# EasyEDA Pro project ProProject_智芯-TI驱动板_2024-06-05.epro

# Schematic Schematic1
Create Date: 2024-04-11; Page Name: P1; Project Name: 智芯-TI驱动板; Schematic Name: Schematic1; Update Date: 2024-04-12; Company: 嘉立创EDA; Page Size: A4; Version: V1.0
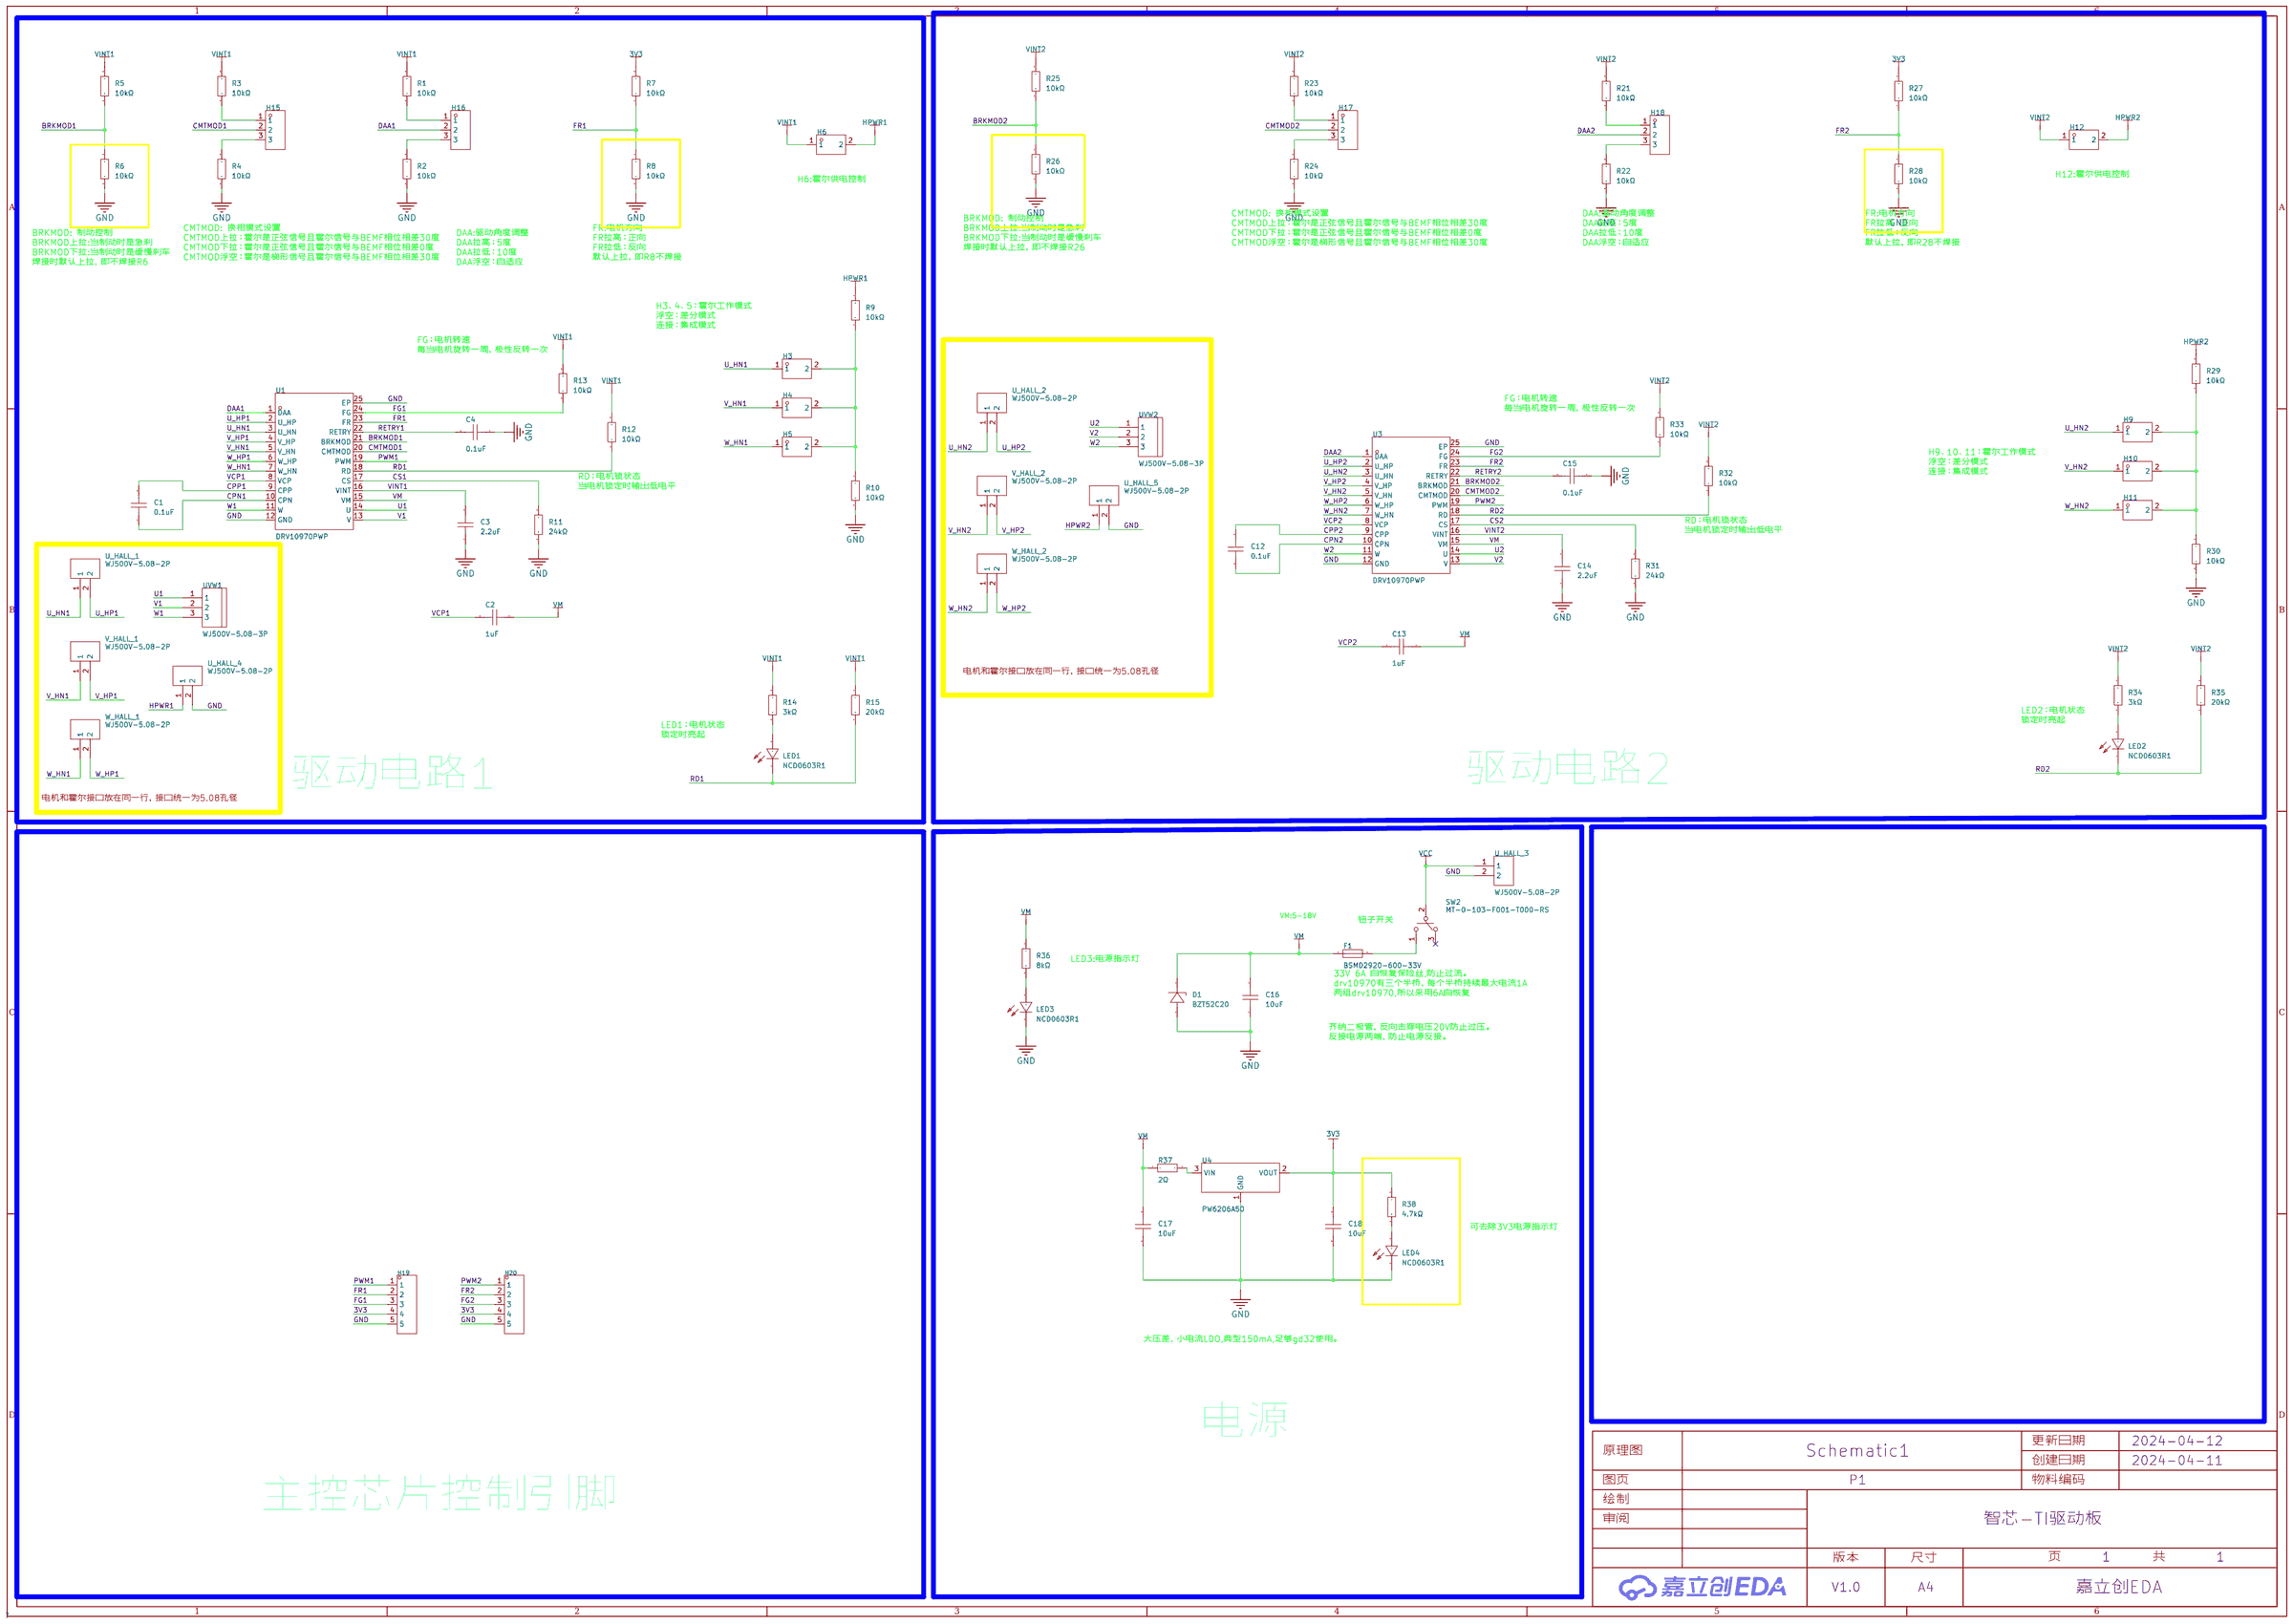
[diagram p0: schematic sheet]

## Parts
C1  0.1uF  [C0603]
C2  1uF  [C0603]
C3  2.2uF  [C0603]
C4  0.1uF  [C0603]
C12  0.1uF  [C0603]
C13  1uF  [C0603]
C14  2.2uF  [C0603]
C15  0.1uF  [C0603]
C16  10uF  [C0603]
C17  10uF  [C0603]
C18  10uF  [C0603]
D1  BZT52C20  [SOD-123_L2.7-W1.6-LS3.7-RD-1]
F1  BSMD2920-600-33V  [F2920]
H3  -  [HDR-TH_2P-P2.54-V-M-2]
H4  -  [HDR-TH_2P-P2.54-V-M-2]
H5  -  [HDR-TH_2P-P2.54-V-M-2]
H6  -  [HDR-TH_2P-P2.54-V-M-2]
H9  -  [HDR-TH_2P-P2.54-V-M-2]
H10  -  [HDR-TH_2P-P2.54-V-M-2]
H11  -  [HDR-TH_2P-P2.54-V-M-2]
H12  -  [HDR-TH_2P-P2.54-V-M-2]
H15  -  [HDR-TH_3P-P2.54-V-M]
H16  -  [HDR-TH_3P-P2.54-V-M]
H17  -  [HDR-TH_3P-P2.54-V-M]
H18  -  [HDR-TH_3P-P2.54-V-M]
H19  -  [HDR-TH_5P-P2.54-V-M]
H20  -  [HDR-TH_5P-P2.54-V-M]
LED1  NCD0603R1  [LED0603-RD_RED]
LED2  NCD0603R1  [LED0603-RD_RED]
LED3  NCD0603R1  [LED0603-RD_RED]
LED4  NCD0603R1  [LED0603-RD_RED]
R1  10kΩ  [R0603]
R2  10kΩ  [R0603]
R3  10kΩ  [R0603]
R4  10kΩ  [R0603]
R5  10kΩ  [R0603]
R6  10kΩ  [R0603]
R7  10kΩ  [R0603]
R8  10kΩ  [R0603]
R9  10kΩ  [R0603]
R10  10kΩ  [R0603]
R11  24kΩ  [R0603]
R12  10kΩ  [R0603]
R13  10kΩ  [R0603]
R14  3kΩ  [R0603]
R15  20kΩ  [R0603]
R21  10kΩ  [R0603]
R22  10kΩ  [R0603]
R23  10kΩ  [R0603]
R24  10kΩ  [R0603]
R25  10kΩ  [R0603]
R26  10kΩ  [R0603]
R27  10kΩ  [R0603]
R28  10kΩ  [R0603]
R29  10kΩ  [R0603]
R30  10kΩ  [R0603]
R31  24kΩ  [R0603]
R32  10kΩ  [R0603]
R33  10kΩ  [R0603]
R34  3kΩ  [R0603]
R35  20kΩ  [R0603]
R36  8kΩ  [R0603]
R37  2Ω  [R0603]
R38  4.7kΩ  [R0603]
SW2  MT-0-103-F001-T000-RS  [SW-TH_MT-0-103-A101-M200-RS]
U1  DRV10970PWP  [HTSSOP-24_L7.8-W4.4-P0.65-LS6.4-BL-EP]
U3  DRV10970PWP  [HTSSOP-24_L7.8-W4.4-P0.65-LS6.4-BL-EP]
U4  PW6206A50  [SOT-23-3_L2.9-W1.6-P1.90-LS2.8-BR]
U_HALL_1  WJ500V-5.08-2P  [CONN-TH_2P-P5.00_WJ500V-5.08-2P]
U_HALL_2  WJ500V-5.08-2P  [CONN-TH_2P-P5.00_WJ500V-5.08-2P]
U_HALL_3  WJ500V-5.08-2P  [CONN-TH_2P-P5.00_WJ500V-5.08-2P]
U_HALL_4  WJ500V-5.08-2P  [CONN-TH_2P-P5.00_WJ500V-5.08-2P]
U_HALL_5  WJ500V-5.08-2P  [CONN-TH_2P-P5.00_WJ500V-5.08-2P]
UVW1  WJ500V-5.08-3P  [CONN-TH_3P-P5.00_WJ500V-5.08-3P]
UVW2  WJ500V-5.08-3P  [CONN-TH_3P-P5.00_WJ500V-5.08-3P]
V_HALL_1  WJ500V-5.08-2P  [CONN-TH_2P-P5.00_WJ500V-5.08-2P]
V_HALL_2  WJ500V-5.08-2P  [CONN-TH_2P-P5.00_WJ500V-5.08-2P]
W_HALL_1  WJ500V-5.08-2P  [CONN-TH_2P-P5.00_WJ500V-5.08-2P]
W_HALL_2  WJ500V-5.08-2P  [CONN-TH_2P-P5.00_WJ500V-5.08-2P]

## Library data of the parts
C1-C4 C12-C18 = CC0603KRX7R9BB104: 容值:100nF;精度:±10%;额定电压:50V;材质(温度系数):X7R;; LCSC Part Name: 100nF ±10% 50V; Supplier Part: C14663; Manufacturer: YAGEO(国巨); Supplier Footprint: 0603; JLCPCB Part Class: 基础库; Datasheet: https://atta.szlcsc.com/upload/public/pdf/source/20180910/C282072_33301C7F631E79921B82A8DAC6BCC5B3.pdf; Supplier: LCSC; Tolerance: ±10%; Voltage Rated: 50V; Temperature Coefficient: X7R
D1 = BZT52C20_C511888: 二极管配置:独立式;稳压值(标称值):20V;稳压值(范围):18.8V~21.2V;功率:500mW;精度:-;; Supplier Part: C511888; Manufacturer: BORN(伯恩半导体); Supplier Footprint: SOD-123; JLCPCB Part Class: 扩展库; Datasheet: https://atta.szlcsc.com/upload/public/pdf/source/20180820/C271262_D2D0F24DD5A81EAE2A6B8B493A94E64A.pdf; Supplier: LCSC; Diode Configuration: 独立式; Zener Voltage (Nom): 20V; Reverse Leakage Current (Ir): 100nA@14V; Zener Voltage (Range): 18.8V~21.2V; Power Dissipation: 500mW; Zener Impedance (Zzt): 55Ω
F1 = BSMD2920-600-16V: 最大电压:16V;最大电流:40A;保持电流:6A;跳闸电流:12A;; LCSC Part Name: 2920 6A 16V 佰宏大电流; Supplier Part: C910847; Manufacturer: BHFUSE(佰宏); Supplier Footprint: 2920; JLCPCB Part Class: 扩展库; Datasheet: https://atta.szlcsc.com/upload/public/pdf/source/20230512/D022CCFE0A7F15633C929F419B252442.pdf; Supplier: LCSC; Operating Voltage (Max): 16V; Current Rating (Max): 40A; Hold Current: 6A; Trip Current: 12A; Power Dissipation: 2W; Resistance - Initial (Ri) (Min): 4mΩ; Resistance - Post Trip (R1) (Max): 20mΩ; Maximum Time to Trip: 6s; Operating Temperature: -40℃~+85℃
H3-H6 H9-H12 = HDR-M_2.54_2x1: Supplier Part: C2883961; Supplier Footprint: 插件,P=2.54mm
H15-H18 = HDR-M_2.54_1x3P: Supplier Part: C2937625; Supplier Footprint: 插件
H19 H20 = HDR-M_2.54_1x5P: Supplier Part: C358687; Supplier Footprint: 插件
LED1-LED4 = NCD0603R1_C84263: 灯头类型:-;发光颜色:红色;正向电压(VF):1.6V~2.6V;功率:65mW;正向电流:20mA;主波长:615nm~630nm;二极管配置:独立二极管;透镜颜色:无色透明透镜;色温:-;发光强度:80mcd~220mcd;发光角度:130°;载带方式:-;工作温度:-30℃~+85℃;; Supplier Part: C84263; Manufacturer: 国星光电; Supplier Footprint: 0603; JLCPCB Part Class: 扩展库; Datasheet: https://atta.szlcsc.com/upload/public/pdf/source/20200820/C84263_DABC6A75E58F576973B407FDBA283D60.pdf; Supplier: LCSC; Emitted Color: 红色; Forward Voltage (VF): 1.6V~2.6V; Power Dissipation: 65mW; Forward Current: 20mA; Dominant Wavelength: 615nm~630nm; Diode Configuration: 独立二极管; Lens Color: 无色透明透镜; Luminous Intensity: 80mcd~220mcd; Viewing Angle: 130°; Operating Temperature: -30℃~+85℃
R1-R15 R21-R38 = 0603WAF1002T5E: 电阻类型:厚膜电阻;阻值:10kΩ;精度:±1%;功率:100mW;最大工作电压:75V;温度系数:±100ppm/℃;; LCSC Part Name: 厚膜电阻 10kΩ ±1% 100mW; Supplier Part: C25804; Manufacturer: UNI-ROYAL(厚声); Supplier Footprint: 0603; JLCPCB Part Class: 基础库; Datasheet: https://atta.szlcsc.com/upload/public/pdf/source/20200306/C422600_1E6D84923E4A46A82E41ADD87F860B5C.pdf; Supplier: LCSC; Type: 厚膜电阻; Tolerance: ±1%; Power(Watts): 100mW; Overload Voltage (Max): 75V; Temperature Coefficient: ±100ppm/℃; Operating Temperature Range: -55℃~+155℃
SW2 = MT-0-103-F001-T000-RS: 电路结构:单刀双掷;机械寿命:-;额定电流:5A;额定电压(AC):125V;安装方式:直插;; LCSC Part Name: 小型钮子三脚三档(短扁柄) 二件套  含配件; Supplier Part: C1788498; Manufacturer: YUEN FUNG(源丰); Supplier Footprint: 插件; JLCPCB Part Class: 扩展库; Datasheet: https://atta.szlcsc.com/upload/public/pdf/source/20230720/304699D0899DE2C80C9B6CEBA5197A73.pdf; Supplier: LCSC; Circuit: 单刀双掷; Switch Length: 13.1mm; Switch Width: 8mm; Switch Height: 30.45mm; Contact Current: 5A; Voltage Rating (AC): 125V; Actuator Type: 扁杆钮柄; Pin Style: 焊片; Mounting Style: 直插; Operating Temperature: -25℃~+85℃
U1 U3 = DRV10970PWP: 驱动电机类型:无刷直流BLDC;电源电压:5V~18V;输出电流:1.5A;接口:PWM;; LCSC Part Name: 1.5A 无刷直流BLDC电机驱动芯片 18V; Supplier Part: C1556993; Manufacturer: TI(德州仪器); Supplier Footprint: HTSSOP-24-EP; JLCPCB Part Class: 扩展库; Datasheet: https://www.ti.com/cn/lit/gpn/drv10970; Supplier: LCSC; Drive motor type: 无刷直流BLDC; Supply Voltage: 5V~18V; Output Current: 1.5A; Interface: PWM; Operating Temperature: -40℃~+125℃@(Tj)
U4 = PW6206A50: IN: 4.5V-40V OUT:5V 250mA; Datasheet: https://www.pwchip.com/product/PW6206-34.html
U_HALL_1-U_HALL_5 V_HALL_1 V_HALL_2 W_HALL_1 W_HALL_2 = WJ500V-5.08-2P: 结构:1x2P;间距:5.08mm;颜色:绿色;安装方式:直插;额定电流:18A;额定电压:250V;排数:1;线规 - AWG:14~30;线规 - 平方毫米:2.5;每排PIN数:2;工作温度范围:-40℃~+105℃;; LCSC Part Name: 5.08mm 1x2P 排数:1 每排P数:2 直插; Supplier Part: C8465; Manufacturer: KANGNEX(康奈克斯电气); Supplier Footprint: 插件,P=5.08mm; JLCPCB Part Class: 扩展库; Datasheet: https://atta.szlcsc.com/upload/public/pdf/source/20191225/C8465_02D34CE5B5B4A53DF5891601D97FA9F4.pdf; Supplier: LCSC; Structure: 1x2P; Pitch: 5.08mm; Color: 绿色; Mounting Style: 直插; Current Rating (Max): 18A; Voltage Rating (Max): 250V; Number of Pins: 2P; Number of Rows: 1; Wire Gauge - AWG: 14~30; Wire Gauge - mm2: 2.5; Number of PINs Per Row: 2; Operating Temperature Range: -40℃~+105℃
UVW1 UVW2 = WJ500V-5.08-3P: 结构:1x3P;间距:5.08mm;颜色:绿色;安装方式:直插;额定电流:18A;额定电压:250V;排数:1;线规 - AWG:14~30;线规 - 平方毫米:2.5;每排PIN数:3;工作温度范围:-40℃~+105℃;; LCSC Part Name: 5.08mm 1x3P 排数:1 每排P数:3 直插; Supplier Part: C72334; Manufacturer: KANGNEX(康奈克斯电气); Supplier Footprint: 插件,P=5.08mm; JLCPCB Part Class: 扩展库; Datasheet: https://atta.szlcsc.com/upload/public/pdf/source/20191225/C72334_8A5EF831D67650233B6B1E3F2BC06274.pdf; Supplier: LCSC; Structure: 1x3P; Pitch: 5.08mm; Color: 绿色; Mounting Style: 直插; Current Rating (Max): 18A; Voltage Rating (Max): 250V; Number of Pins: 3P; Number of Rows: 1; Wire Gauge - AWG: 14~30; Wire Gauge - mm2: 2.5; Number of PINs Per Row: 3; Operating Temperature Range: -40℃~+105℃

## Nets
3V3: C18.1 H19.4 H20.4 R7.2 R27.2 R38.1 U4.2(VOUT)
GND: C3.1 C4.1 C14.1 C15.1 C16.2 C17.2 C18.2 D1.2(A) H19.5 H20.5 LED3.1(K) LED4.1(K) R2.2 R4.2 R6.2 R8.2 R10.2 R11.2 R22.2 R24.2 R26.2 R28.2 R30.2 R31.2 U1.12(GND) U1.25(EP) U3.12(GND) U3.25(EP) U4.1(GND) U_HALL_3.2 U_HALL_4.2 U_HALL_5.2
V1: U1.13(V) UVW1.2
V2: U3.13(V) UVW2.2
VCC: SW2.2 U_HALL_3.1
VINT1: C3.2 H6.1 R1.2 R3.2 R5.2 R12.2 R13.2 R14.1 R15.1 U1.16(VINT)
VINT2: C14.2 H12.1 R21.2 R23.2 R25.2 R32.2 R33.2 R34.1 R35.1 U3.16(VINT)
BRKMOD1: R5.1 R6.1 U1.21(BRKMOD)
BRKMOD2: R25.1 R26.1 U3.21(BRKMOD)
CMTMOD1: H15.2 U1.20(CMTMOD)
CMTMOD2: H17.2 U3.20(CMTMOD)
CPN1: C1.1 U1.10(CPN)
CPN2: C12.1 U3.10(CPN)
CPP1: C1.2 U1.9(CPP)
CPP2: C12.2 U3.9(CPP)
CS1: R11.1 U1.17(CS)
CS2: R31.1 U3.17(CS)
DAA1: H16.2 U1.1(DAA)
DAA2: H18.2 U3.1(DAA)
FG1: H19.3 R13.1 U1.24(FG)
FG2: H20.3 R33.1 U3.24(FG)
FR1: H19.2 R7.1 R8.1 U1.23(FR)
FR2: H20.2 R27.1 R28.1 U3.23(FR)
HPWR1: H6.2 R9.2 U_HALL_4.1
HPWR2: H12.2 R29.2 U_HALL_5.1
PWM1: H19.1 U1.19(PWM)
PWM2: H20.1 U3.19(PWM)
RD1: LED1.1(K) R12.1 R15.2 U1.18(RD)
RD2: LED2.1(K) R32.1 R35.2 U3.18(RD)
RETRY1: C4.2 U1.22(RETRY)
RETRY2: C15.2 U3.22(RETRY)
U1: U1.14(U) UVW1.1
U2: U3.14(U) UVW2.1
U_HN1: H3.1 U1.3(U_HN) U_HALL_1.1
U_HN2: H9.1 U3.3(U_HN) U_HALL_2.1
U_HP1: U1.2(U_HP) U_HALL_1.2
U_HP2: U3.2(U_HP) U_HALL_2.2
V_HN1: H4.1 U1.5(V_HN) V_HALL_1.1
V_HN2: H10.1 U3.5(V_HN) V_HALL_2.1
V_HP1: U1.4(V_HP) V_HALL_1.2
V_HP2: U3.4(V_HP) V_HALL_2.2
VCP1: C2.2 U1.8(VCP)
VCP2: C13.2 U3.8(VCP)
VM: C2.1 C13.1 C16.1 C17.1 D1.1(K) F1.1 R36.1 R37.1 U1.15(VM) U3.15(VM)
W1: U1.11(W) UVW1.3
W2: U3.11(W) UVW2.3
W_HN1: H5.1 U1.7(W_HN) W_HALL_1.1
W_HN2: H11.1 U3.7(W_HN) W_HALL_2.1
W_HP1: U1.6(W_HP) W_HALL_1.2
W_HP2: U3.6(W_HP) W_HALL_2.2
$1N4320: H16.1 R1.1
$1N4321: H16.3 R2.1
$1N4326: H15.1 R3.1
$1N4327: H15.3 R4.1
$1N4400: H3.2 H4.2 H5.2 R9.1 R10.1
$1N4410: LED1.2(A) R14.2
$1N4451: H18.1 R21.1
$1N4452: H18.3 R22.1
$1N4457: H17.1 R23.1
$1N4458: H17.3 R24.1
$1N4519: H9.2 H10.2 H11.2 R29.1 R30.1
$1N4529: LED2.2(A) R34.2
$1N4533: LED3.2(A) R36.2
$1N4538: F1.2 SW2.1
$1N4569: R37.2 U4.3(VIN)
$1N4570: LED4.2(A) R38.2

Not connected (* = marked no-connect by the designer): SW2 3*

## Notes on the sheet
- H12:霍尔供电控制
- H6:霍尔供电控制
- CMTMOD: 换相模式设置
  CMTMOD上拉：霍尔是正弦信号且霍尔信号与BEMF相位相差30度
  CMTMOD下拉：霍尔是正弦信号且霍尔信号与BEMF相位相差0度
  CMTMOD浮空：霍尔是梯形信号且霍尔信号与BEMF相位相差30度
- DAA:驱动角度调整
  DAA拉高：5度
  DAA拉低：10度
  DAA浮空：自适应
- FR:电机方向
  FR拉高：正向
  FR拉低：反向
  默认上拉，即R28不焊接
- CMTMOD: 换相模式设置
  CMTMOD上拉：霍尔是正弦信号且霍尔信号与BEMF相位相差30度
  CMTMOD下拉：霍尔是正弦信号且霍尔信号与BEMF相位相差0度
  CMTMOD浮空：霍尔是梯形信号且霍尔信号与BEMF相位相差30度
- FR:电机方向
  FR拉高：正向
  FR拉低：反向
  默认上拉，即R8不焊接
- BRKMOD: 制动控制
  BRKMOD上拉:当制动时是急刹
  BRKMOD下拉:当制动时是缓慢刹车
  焊接时默认上拉，即不焊接R26
- BRKMOD: 制动控制
  BRKMOD上拉:当制动时是急刹
  BRKMOD下拉:当制动时是缓慢刹车
  焊接时默认上拉，即不焊接R6
- DAA:驱动角度调整
  DAA拉高：5度
  DAA拉低：10度
  DAA浮空：自适应
- H3、4、5：霍尔工作模式
  浮空：差分模式
  连接：集成模式
- FG：电机转速
  每当电机旋转一周，极性反转一次
- FG：电机转速
  每当电机旋转一周，极性反转一次
- H9、10、11：霍尔工作模式
  浮空：差分模式
  连接：集成模式
- RD：电机锁状态
  当电机锁定时输出低电平
- RD：电机锁状态
  当电机锁定时输出低电平
- 电机和霍尔接口放在同一行，接口统一为5.08孔径
- LED2：电机状态
  锁定时亮起
- LED1：电机状态
  锁定时亮起
- 驱动电路2
- 电机和霍尔接口放在同一行，接口统一为5.08孔径
- 驱动电路1
- VM:5-18V
- 钮子开关
- LED3:电源指示灯
- 33V 6A 自恢复保险丝,防止过流。
  drv10970有三个半桥，每个半桥持续最大电流1A
  两组drv10970,所以采用6A自恢复
- 齐纳二极管，反向击穿电压20V防止过压。
  反接电源两端，防止电源反接。
- 可去除3V3电源指示灯
- 大压差，小电流LDO,典型150mA,足够gd32使用。
- 电源
- 主控芯片控制引脚

# Board PCB1
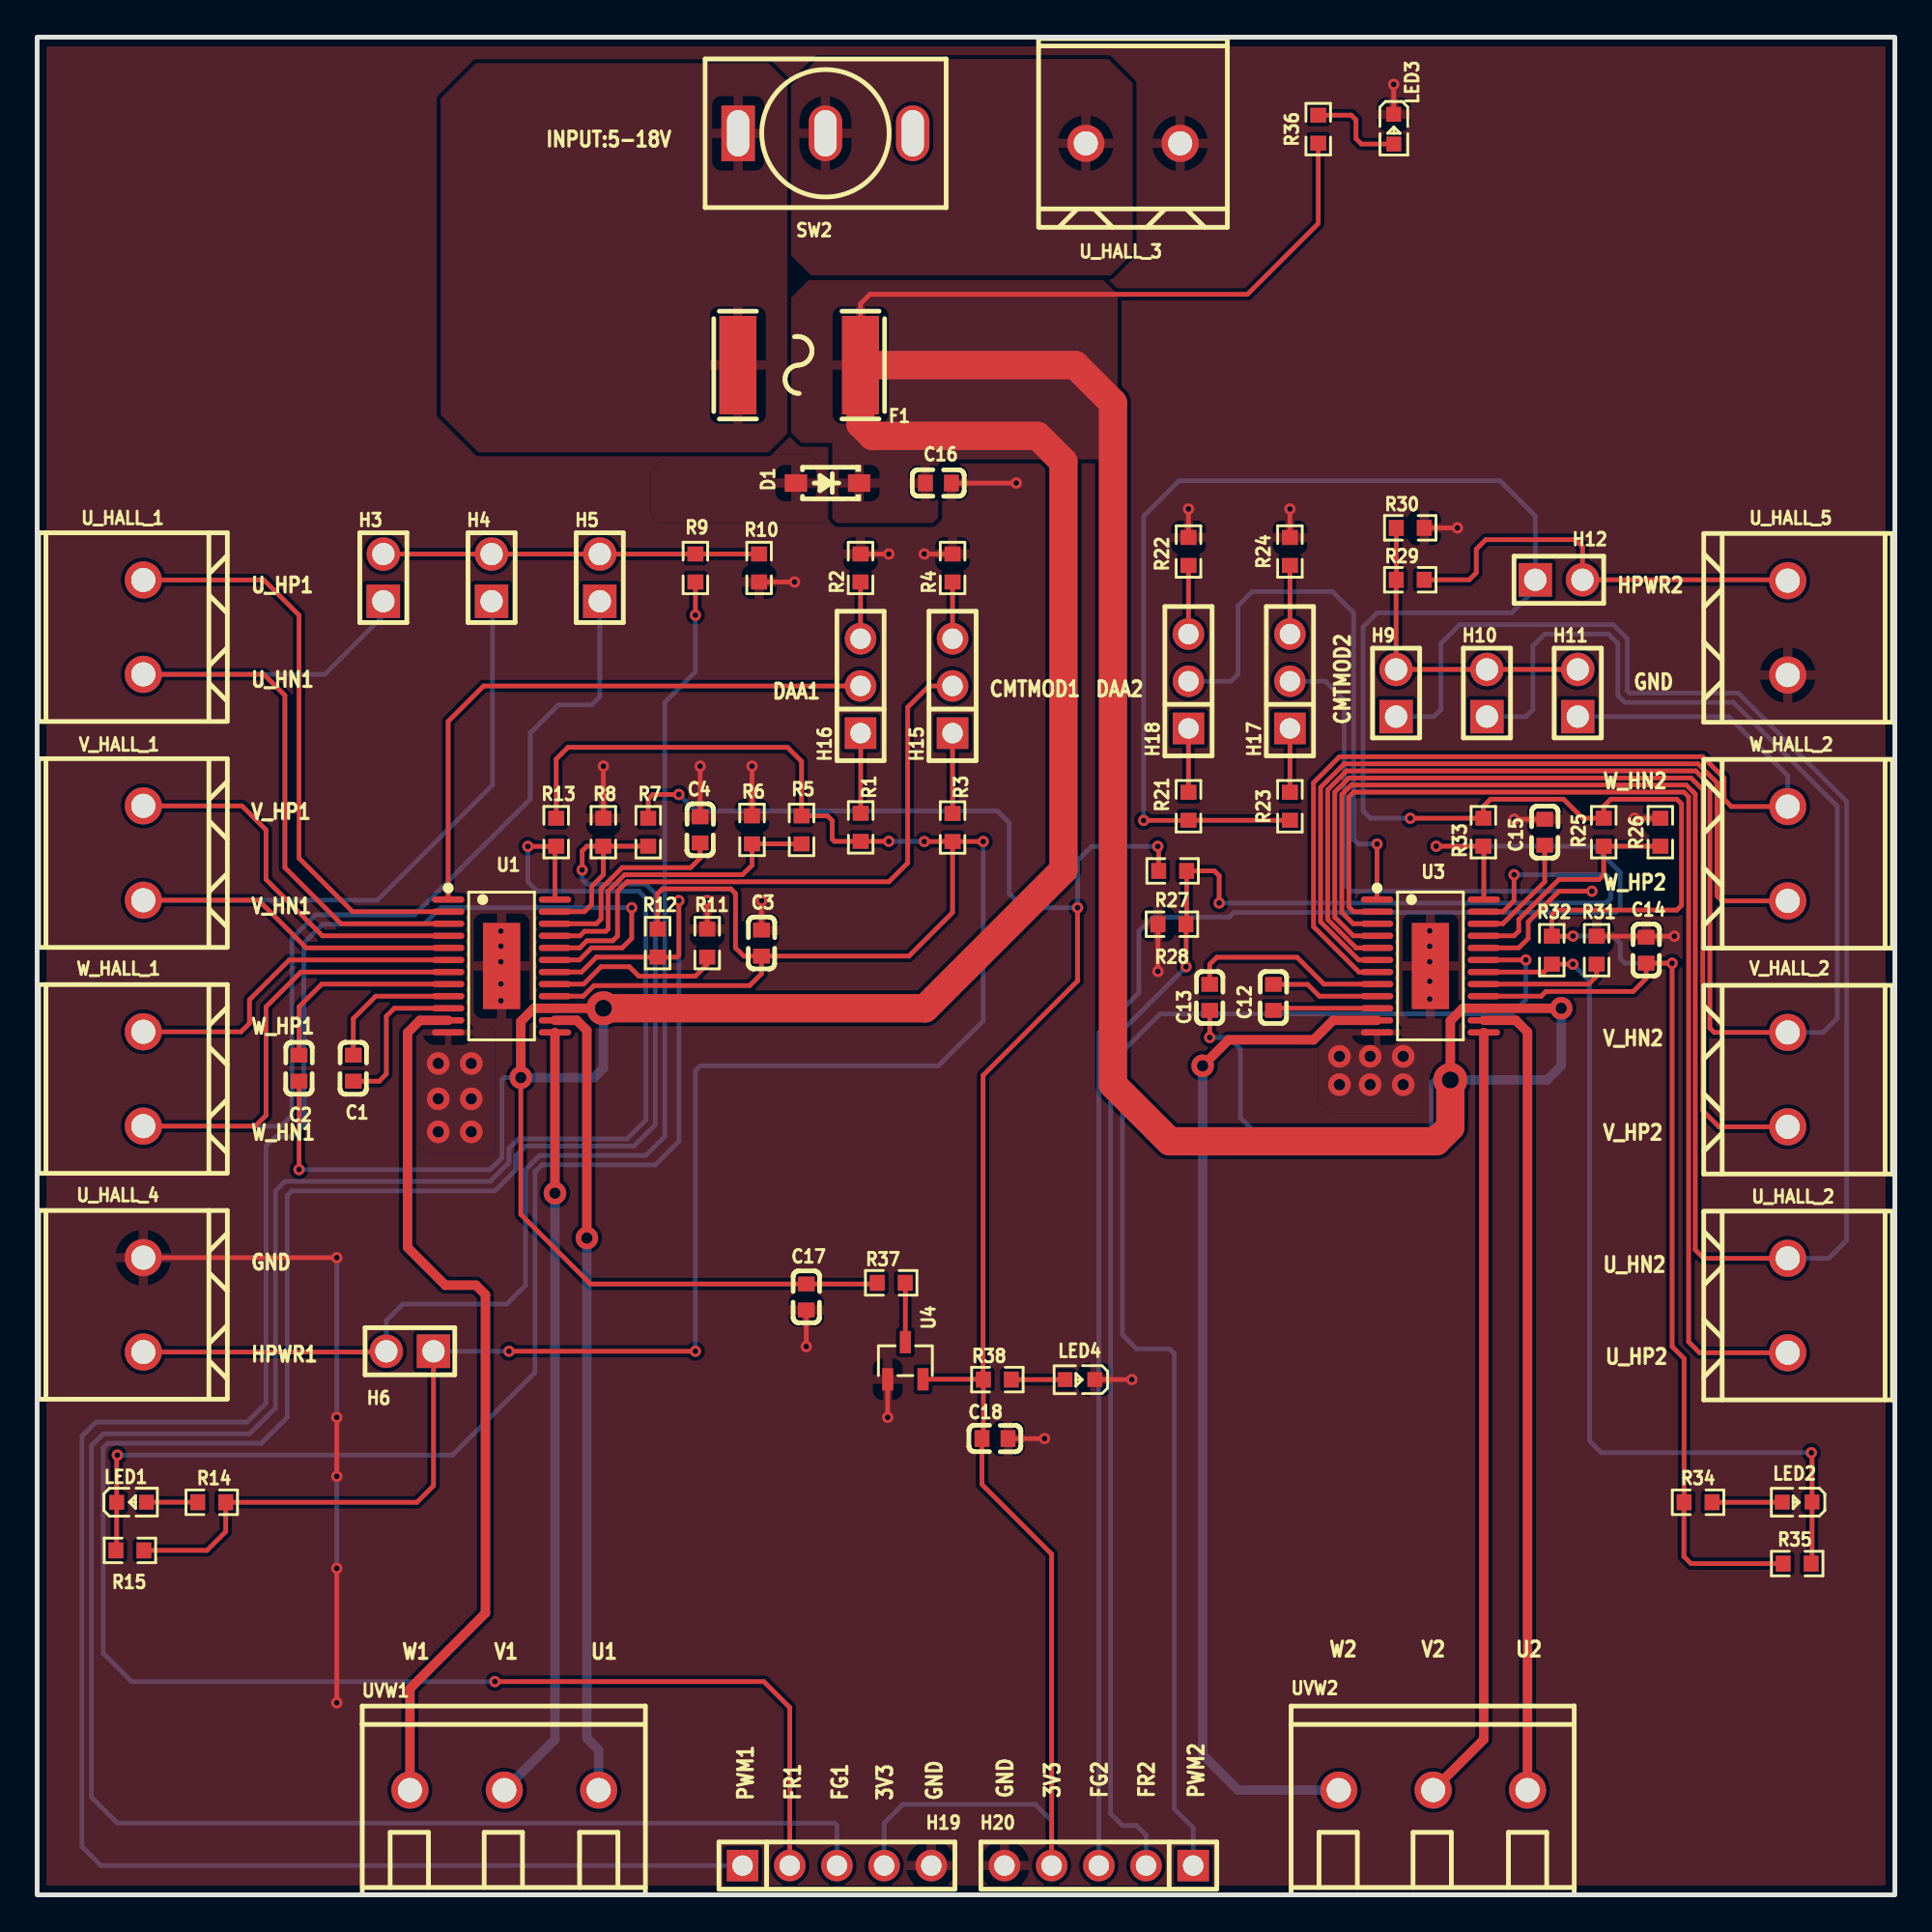
[diagram p1: board, top side]
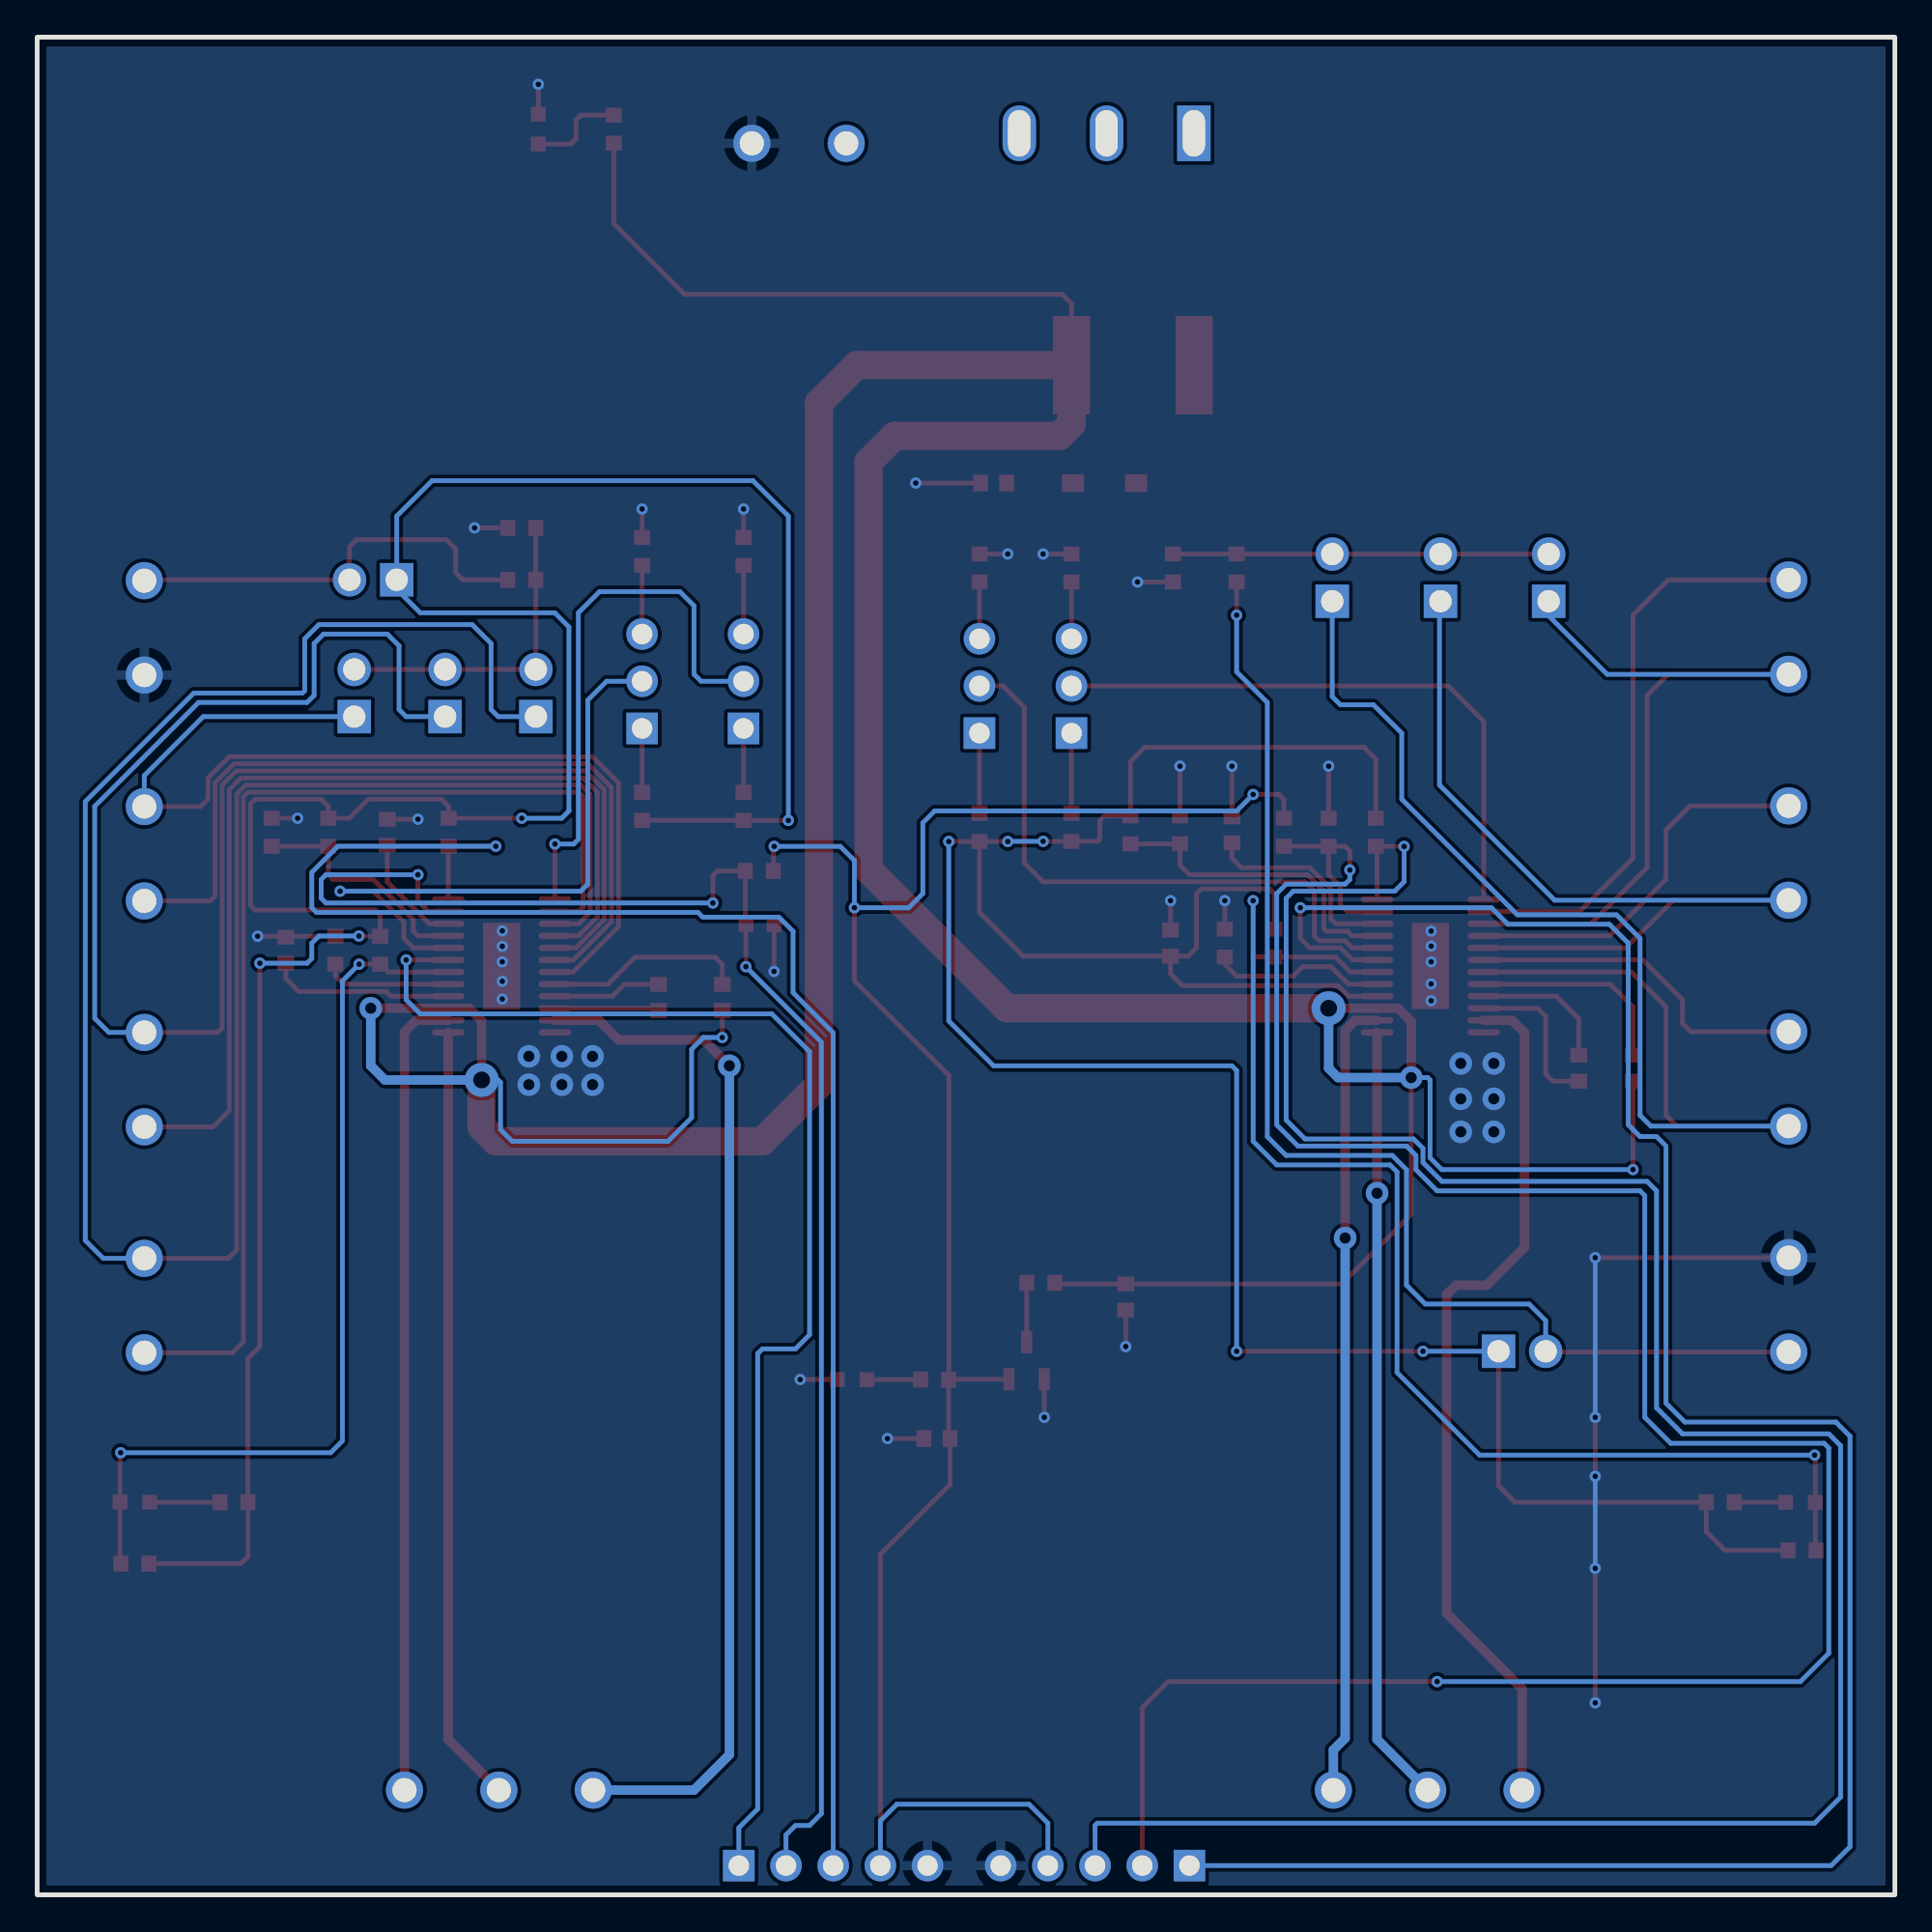
[diagram p2: board, bottom side, seen from below]

Outline 100 x 100 mm; copper layers: Top Layer, Bottom Layer. Coordinates in mm from the lower left corner of the outline.
Outline path: rectangle 0,100 100,0
Stack: Top Layer 0.035mm / Dielectric1 1.51mm FR4 er 4.5 / Bottom Layer 0.035mm

## Design rules (mm)
template: 自定义配置
spacing copperThickness1oz (default): track to track 0.102, other pairs 0.152 to 0.3
spacing copperThickness2oz: track to track 0.203, other pairs 0.152 to 0.3
track width copperThickness1oz (default): min 0.127, default 0.254, max 2.54
track width copperThickness2oz: min 0.203, default 0.254, max 2.54
differential pair differentialPair (default): width min 0.127, default 0.254, max 2.54; gap min 0.152, default 0.152
via viaSize (default): diameter min 0.5, default 0.61, max 10; hole min 0.3, default 0.305, max 6.299

## Placement (name value [footprint] x y rotation side)
C1  0.1uF  [C0603]  17.02 44.5 90 top
C2  1uF  [C0603]  14.1 44.5 90 top
C3  2.2uF  [C0603]  38.99 51.23 270 top
C4  0.1uF  [C0603]  35.69 57.33 270 top
C12  0.1uF  [C0603]  66.55 48.31 90 top
C13  1uF  [C0603]  63.12 48.31 90 top
C14  2.2uF  [C0603]  86.61 50.85 270 top
C15  0.1uF  [C0603]  81.15 57.2 270 top
C16  10uF  [C0603]  48.51 76 0 top
C17  10uF  [C0603]  41.4 32.18 270 top
C18  10uF  [C0603]  51.56 24.56 0 top
D1  BZT52C20  [SOD-123_L2.7-W1.6-LS3.7-RD-1]  42.54 76 180 top
F1  BSMD2920-600-33V  [F2920]  41.02 82.35 180 top
H3  -  [HDR-TH_2P-P2.54-V-M-2]  18.64 70.91 0 top
H4  -  [HDR-TH_2P-P2.54-V-M-2]  24.46 70.91 0 top
H5  -  [HDR-TH_2P-P2.54-V-M-2]  30.29 70.91 0 top
H6  -  [HDR-TH_2P-P2.54-V-M-2]  20.07 29.26 90 top
H9  -  [HDR-TH_2P-P2.54-V-M-2]  73.15 64.69 0 top
H10  -  [HDR-TH_2P-P2.54-V-M-2]  78.04 64.69 0 top
H11  -  [HDR-TH_2P-P2.54-V-M-2]  82.93 64.69 0 top
H12  -  [HDR-TH_2P-P2.54-V-M-2]  81.91 70.79 270 top
H15  -  [HDR-TH_3P-P2.54-V-M]  49.28 65.08 90 top
H16  -  [HDR-TH_3P-P2.54-V-M]  44.32 65.08 90 top
H17  -  [HDR-TH_3P-P2.54-V-M]  67.44 65.33 90 top
H18  -  [HDR-TH_3P-P2.54-V-M]  61.98 65.33 90 top
H19  -  [HDR-TH_5P-P2.54-V-M]  43.05 1.57 0 top
H20  -  [HDR-TH_5P-P2.54-V-M]  57.15 1.57 180 top
LED1  NCD0603R1  [LED0603-RD_RED]  5.08 21.13 0 top
LED2  NCD0603R1  [LED0603-RD_RED]  94.74 21.14 180 top
LED3  NCD0603R1  [LED0603-RD_RED]  73.03 95.05 270 top
LED4  NCD0603R1  [LED0603-RD_RED]  56.13 27.74 180 top
R1  10kΩ  [R0603]  44.33 57.46 270 top
R2  10kΩ  [R0603]  44.32 71.42 90 top
R3  10kΩ  [R0603]  49.28 57.45 270 top
R4  10kΩ  [R0603]  49.28 71.42 90 top
R5  10kΩ  [R0603]  41.15 57.33 90 top
R6  10kΩ  [R0603]  38.48 57.33 90 top
R7  10kΩ  [R0603]  32.89 57.2 90 top
R8  10kΩ  [R0603]  30.48 57.2 90 top
R9  10kΩ  [R0603]  35.43 71.42 270 top
R10  10kΩ  [R0603]  38.86 71.42 270 top
R11  24kΩ  [R0603]  36.07 51.23 90 top
R12  10kΩ  [R0603]  33.4 51.23 90 top
R13  10kΩ  [R0603]  27.94 57.2 90 top
R14  3kΩ  [R0603]  9.4 21.13 180 top
R15  20kΩ  [R0603]  4.99 18.54 180 top
R21  10kΩ  [R0603]  61.98 58.6 270 top
R22  10kΩ  [R0603]  61.98 72.31 90 top
R23  10kΩ  [R0603]  67.44 58.6 270 top
R24  10kΩ  [R0603]  67.44 72.31 90 top
R25  10kΩ  [R0603]  84.33 57.2 90 top
R26  10kΩ  [R0603]  87.38 57.2 90 top
R27  10kΩ  [R0603]  61.12 55.12 180 top
R28  10kΩ  [R0603]  61.09 52.25 180 top
R29  10kΩ  [R0603]  73.91 70.79 0 top
R30  10kΩ  [R0603]  73.91 73.58 0 top
R31  24kΩ  [R0603]  83.95 50.85 90 top
R32  10kΩ  [R0603]  81.53 50.85 90 top
R33  10kΩ  [R0603]  77.85 57.2 90 top
R34  3kΩ  [R0603]  89.41 21.13 0 top
R35  20kΩ  [R0603]  94.74 17.83 0 top
R36  8kΩ  [R0603]  68.96 95.05 90 top
R37  2Ω  [R0603]  45.97 32.94 0 top
R38  4.7kΩ  [R0603]  51.69 27.74 0 top
SW2  MT-0-103-F001-T000-RS  [SW-TH_MT-0-103-A101-M200-RS]  42.43 94.83 0 top
U1  DRV10970PWP  [HTSSOP-24_L7.8-W4.4-P0.65-LS6.4-BL-EP]  25 50 270 top
U3  DRV10970PWP  [HTSSOP-24_L7.8-W4.4-P0.65-LS6.4-BL-EP]  75 50 270 top
U4  PW6206A50  [SOT-23-3_L2.9-W1.6-P1.90-LS2.8-BR]  46.74 28.75 270 top
U_HALL_1  WJ500V-5.08-2P  [CONN-TH_2P-P5.00_WJ500V-5.08-2P]  5.72 68.24 90 top
U_HALL_2  WJ500V-5.08-2P  [CONN-TH_2P-P5.00_WJ500V-5.08-2P]  94.23 31.72 270 top
U_HALL_3  WJ500V-5.08-2P  [CONN-TH_2P-P5.00_WJ500V-5.08-2P]  58.99 94.28 0 top
U_HALL_4  WJ500V-5.08-2P  [CONN-TH_2P-P5.00_WJ500V-5.08-2P]  5.72 31.76 90 top
U_HALL_5  WJ500V-5.08-2P  [CONN-TH_2P-P5.00_WJ500V-5.08-2P]  94.23 68.2 270 top
UVW1  WJ500V-5.08-3P  [CONN-TH_3P-P5.00_WJ500V-5.08-3P]  25.15 5.64 180 top
UVW2  WJ500V-5.08-3P  [CONN-TH_3P-P5.00_WJ500V-5.08-3P]  75.15 5.64 180 top
V_HALL_1  WJ500V-5.08-2P  [CONN-TH_2P-P5.00_WJ500V-5.08-2P]  5.72 56.08 90 top
V_HALL_2  WJ500V-5.08-2P  [CONN-TH_2P-P5.00_WJ500V-5.08-2P]  94.23 43.88 270 top
W_HALL_1  WJ500V-5.08-2P  [CONN-TH_2P-P5.00_WJ500V-5.08-2P]  5.72 43.92 90 top
W_HALL_2  WJ500V-5.08-2P  [CONN-TH_2P-P5.00_WJ500V-5.08-2P]  94.23 56.04 270 top

## Footprints (pads in the part's own frame, mm; a bottom-side part is the same pattern mirrored in y, then rotated)
C0603
  rect 0.8x0.9 smd: 1(-0.7,0) 2(0.7,0)
CONN-TH_2P-P5.00_WJ500V-5.08-2P
  round 2 hole 1.3: 1(-2.54,0) 2(2.54,0)
CONN-TH_3P-P5.00_WJ500V-5.08-3P
  round 2 hole 1.3: 1(-5.08,0) 2(0,0) 3(5.08,0)
F2920
  rect 2x5.3 smd: 1(-3.3,0) 2(3.3,0)
HDR-TH_2P-P2.54-V-M-2
  rect 1.8x1.8 hole 1.2: 1(0,-1.27)
  round 1.8 hole 1.2: 2(0,1.27)
HDR-TH_3P-P2.54-V-M
  rect 1.7x1.7 hole 1.1: 1(-2.54,0)
  round 1.7 hole 1.1: 2(0,0) 3(2.54,0)
HDR-TH_5P-P2.54-V-M
  rect 1.7x1.7 hole 1.1: 1(-5.08,0)
  round 1.7 hole 1.1: 2(-2.54,0) 3(0,0) 4(2.54,0) 5(5.08,0)
HTSSOP-24_L7.8-W4.4-P0.65-LS6.4-BL-EP
  oval 0.343x1.746 smd: 1(-3.575,-2.873) 2(-2.925,-2.873) 3(-2.275,-2.873) 4(-1.625,-2.873) 5(-0.975,-2.873) 6(-0.325,-2.873) 7(0.325,-2.873) 8(0.975,-2.873) 9(1.625,-2.873) 10(2.275,-2.873) 11(2.925,-2.873) 12(3.575,-2.873) 13(3.575,2.873) 14(2.925,2.873) 15(2.275,2.873) 16(1.625,2.873) 17(0.975,2.873) 18(0.325,2.873) 19(-0.325,2.873) 20(-0.975,2.873) 21(-1.625,2.873) 22(-2.275,2.873) 23(-2.925,2.873) 24(-3.575,2.873)
  rect 4.64x2.005 smd: 25(0,0)
LED0603-RD_RED
  rect 0.8x0.8 smd: 1(-0.799,-0.004) 2(0.799,0.004)
R0603
  rect 0.806x0.864 smd: 1(-0.753,0) 2(0.753,0)
SOD-123_L2.7-W1.6-LS3.7-RD-1
  rect 1.2x0.95 smd: 1(-1.7,0) 2(1.7,0)
SOT-23-3_L2.9-W1.6-P1.90-LS2.8-BR
  rect 1.2x0.6 smd: 1(1,-0.95) 2(1,0.95) 3(-1,0)
SW-TH_MT-0-103-A101-M200-RS
  rect 1.8x3 hole 1.2x2.5: 1(-4.7,0)
  oval 1.8x3 hole 1.2x2.5: 2(0,0) 3(4.7,0)

## Nets
As in the schematic.

Pads without a net: SW2 3

## Via types
v1: diameter 1.219, hole 0.61, Top Layer to Bottom Layer, 17 vias
v2: diameter 0.61, hole 0.305, Top Layer to Bottom Layer, 66 vias
v3: diameter 1.829, hole 0.914, Top Layer to Bottom Layer, 2 vias

## Routing (per net, layer and track width the routed paths; a pad name or vN(x,y) marks a point on that pad's centre or on a via; arc(x,y) is an arc through that point)
3V3: length 110.5
  Top Layer w0.254: R7.2 32.89,58.98 33.15,59.23 v2(34.54,59.23) ; v2(60.32,56.44) 60.37,56.39 R27.2 ; 50.92,27.75 R38.1 50.94,24.64 C18.1 50.86,22.09 54.61,18.34 H20.4 ; 50.92,27.75 U4.2 ; 50.92,27.75 50.92,44.11 56.01,49.2 v2(56.01,53.14)
  Bottom Layer w0.254: v2(60.32,56.44) 56.77,56.44 56.01,55.68 v2(56.01,53.14) 53.09,53.14 52.32,53.9 52.32,57.71 51.69,58.34 35.43,58.34 v2(34.54,59.23) ; H20.4 54.61,3.99 53.72,4.88 46.61,4.88 45.59,3.86 H19.4
GND: length 78.4
  Top Layer w0.254: R22.2 v2(61.98,74.6) ; R28.2 v2(60.33,49.71) ; 88.14,51.61 v2(88.13,51.6) 86.56,51.6 ; R11.2 v2(36.07,53.52) ; 86.56,51.6 C14.1 ; 86.56,51.6 R31.2 ; C4.1 v2(35.69,60.76) ; R30.2 v2(76.45,73.58) ; R6.2 v2(38.48,60.76) ; R4.2 v2(47.75,72.18) ; U_HALL_4.2 v2(16.13,34.3) ; R26.2 v2(85.98,57.95) ; C16.2 v2(52.71,76) ; v2(16.13,17.58) v2(16.13,10.34) ; R8.2 v2(30.48,60.76) ; U4.1 v2(45.79,25.71) ; C15.1 v2(79.5,57.9) ; C18.2 v2(54.23,24.56) ; C3.1 v2(38.99,53.52) ; R2.2 v2(45.85,72.18) ; LED4.1 v2(58.93,27.74) ; R24.2 v2(67.44,74.6) ; R10.2 v2(40.77,70.67) ; C17.2 v2(41.4,29.51) ; LED3.1 v2(73.02,97.46) ; v2(16.13,25.71) v2(16.13,22.53)
  Bottom Layer w0.254: v2(16.13,34.3) v2(16.13,25.71) ; v2(16.13,22.53) v2(16.13,17.58)
  vias: v1(21.59,44.75) v1(21.59,42.85) v1(21.59,41.07) v1(23.37,44.75) v1(23.37,42.85) v1(23.37,41.07) v1(70.1,45.14) v1(70.1,43.61) v1(71.75,45.14) v1(71.75,43.61) v1(73.53,45.14) v1(73.53,43.61) v2(24.96,51.88) v2(24.96,51.07) v2(24.96,50.22) v2(24.96,49.03) v2(24.96,48.13) v2(74.96,51.89) v2(74.96,51.06) v2(74.96,50.22) v2(74.96,49.18) v2(74.96,48.22)
V1: length 41.9
  Top Layer w0.508: U1.13 v1(27.87,37.77)
  Bottom Layer w0.508: v1(27.87,37.77) 27.87,8.37 UVW1.2
V2: length 41.9
  Top Layer w0.508: UVW2.2 77.87,8.37 U3.13
VINT1: length 150
  Top Layer w0.254: R3.2 v2(50.93,56.7) ; R3.2 49.28,52.88 46.93,50.53 C3.2 ; R3.2 v2(47.75,56.7) ; C3.2 38.99,49.58 38.35,48.95 29.97,48.95 29.4,48.38 U1.16 ; C3.2 38.04,50.53 37.59,50.98 37.59,53.9 37.34,54.15 33.66,54.15 33.4,53.9 R12.2 ; R15.1 9.14,18.54 10.15,19.55 R14.1 20.45,21.13 21.34,22.02 H6.1 ; R13.2 27.94,61.14 28.57,61.77 40.39,61.77 41.15,61.01 R5.2 42.54,58.08 42.8,57.83 42.8,56.82 42.91,56.71 R1.2 v2(45.85,56.71) ; v2(35.43,29.26) v2(25.4,29.26)
  Bottom Layer w0.254: v2(25.4,29.26) H6.1 ; v2(45.85,56.71) 47.74,56.71 v2(47.75,56.7) ; v2(35.43,29.26) 35.43,44.37 35.69,44.63 48.51,44.63 50.93,47.04 v2(50.93,56.7)
VINT2: length 160.8
  Top Layer w0.254: v2(59.56,57.84) 61.97,57.84 R21.2 R23.2 ; v2(73.91,57.95) R33.2 77.85,58.6 78.23,58.98 82.17,58.98 83.19,57.95 R25.2 84.33,58.6 84.71,58.98 88.26,58.98 88.52,58.72 88.52,53.26 88.26,53.01 81.79,53.01 81.53,52.76 R32.2 82.67,51.6 v2(82.68,51.61) ; U3.16 80.96,48.38 81.22,48.63 85.92,48.63 86.61,49.33 C14.2 v2(88.01,50.15) 88.01,29.51 88.65,28.87 R34.1 88.65,21.12 88.65,18.21 89.03,17.83 R35.1
  Bottom Layer w0.254: v2(73.91,57.95) 71.76,57.95 71.37,58.34 71.37,68.25 72.14,69.01 79.38,69.01 80.65,70.28 H12.1 80.65,74.22 78.74,76.12 61.47,76.12 59.56,74.22 v2(59.56,57.84) ; v2(82.68,51.61) 84.84,51.61 85.22,51.23 85.22,50.41 85.47,50.15 v2(88.01,50.15)
BRKMOD1: length 17.2
  Top Layer w0.254: U1.21 29.22,51.62 29.46,51.87 30.61,51.87 30.73,51.99 30.73,54.03 31.62,54.92 37.97,54.92 38.48,55.42 R6.1 R5.1
BRKMOD2: length 12.8
  Top Layer w0.254: U3.21 79.5,51.62 79.76,51.88 79.76,52.5 81.91,54.66 84.07,54.66 84.33,54.92 R25.1 R26.1
CMTMOD1: length 33.6
  Top Layer w0.254: U1.20 29.21,50.97 29.59,51.36 30.99,51.36 31.24,51.61 31.24,54.03 31.75,54.53 45.85,54.53 46.86,55.55 46.86,63.93 48.01,65.08 H15.2
CMTMOD2: length 34.3
  Top Layer w0.254: U3.20 79.75,50.97 80.26,51.49 80.26,52.38 81.91,54.03 v2(83.69,54.03)
  Bottom Layer w0.254: v2(83.69,54.03) 70.74,54.03 70.36,54.41 70.36,64.31 69.34,65.33 H17.2
CPN1: length 8.6
  Top Layer w0.254: C1.1 18.42,43.8 18.8,44.18 18.8,47.3 19.23,47.72 U1.10
CPN2: length 5.6
  Top Layer w0.254: C12.1 66.66,47.72 U3.10
CPP1: length 7.6
  Top Layer w0.254: 17.02,45.2 17.02,47.17 18.22,48.38 U1.9
CPP2: length 5.8
  Top Layer w0.254: U3.9 69.02,48.38 68.39,49.01 C12.2
CS1: length 9.4
  Top Layer w0.254: R11.1 36.07,50.09 35.43,49.45 32.38,49.45 31.88,49.96 30.35,49.96 29.42,49.03 U1.17
CS2: length 6.9
  Top Layer w0.254: U3.17 83.52,49.03 83.95,49.45 R31.1
DAA1: length 32.6
  Top Layer w0.254: H16.2 24.03,65.08 22.13,63.17 U1.1
DAA2: length 30.1
  Top Layer w0.254: U3.1 v2(72.13,56.57)
  Bottom Layer w0.254: v2(72.13,56.57) 71.12,56.57 70.87,56.82 70.87,69.01 69.72,70.16 65.41,70.16 64.64,69.39 64.64,65.71 64.26,65.33 H18.2
FG1: length 131.2
  Top Layer w0.254: 27.87,56.38 R13.1 ; 27.87,56.38 U1.24 ; 27.87,56.38 27.81,56.44 v2(26.42,56.44)
  Bottom Layer w0.254: v2(26.42,56.44) 26.42,54.53 26.92,54.03 32.38,54.03 32.77,53.64 32.77,41.71 31.75,40.69 25.91,40.69 25.4,40.18 25.4,39.42 24.38,38.41 13.33,38.41 12.83,37.9 12.83,26.21 11.43,24.82 3.56,24.82 2.92,24.18 2.92,5.26 4.32,3.86 42.93,3.86 43.05,3.73 H19.3
FG2: length 95.4
  Top Layer w0.254: v2(75.31,56.45) R33.1 77.87,56.43 U3.24
  Bottom Layer w0.254: v2(75.31,56.45) 83.81,56.45 85.22,55.04 85.22,53.14 84.96,52.88 64.42,52.88 64.17,52.63 60.07,52.63 59.31,51.87 59.31,48.56 57.15,46.41 H20.3
FR1: length 129.5
  Top Layer w0.254: R8.1 30.48,54.92 29.84,54.28 29.84,53.31 29.46,52.92 U1.23 ; R8.1 29.59,56.45 29.34,56.19 v2(29.34,55.17) ; R8.1 R7.1 ; v2(24.64,11.48) 39.12,11.48 40.51,10.08 H19.2
  Bottom Layer w0.254: v2(29.34,55.17) 29.34,54.66 29.59,54.41 32.77,54.41 33.27,53.9 33.27,41.45 32.13,40.31 26.29,40.31 25.78,39.8 25.78,39.03 24.64,37.9 13.72,37.9 13.46,37.64 13.46,25.71 12.06,24.31 3.81,24.31 3.56,24.05 3.56,13 5.08,11.48 v2(24.64,11.48)
FR2: length 90.6
  Top Layer w0.254: v2(79.5,54.92) 79.5,53.52 78.91,52.92 U3.23 ; v2(63.63,53.39) 63.63,54.86 63.37,55.12 R27.1 61.88,52.28 61.85,52.26 ; v2(61.85,49.96) 61.85,52.26 ; 61.85,52.26 R28.1
  Bottom Layer w0.254: v2(79.5,54.92) 84.46,54.92 84.71,54.66 84.71,53.64 84.46,53.39 v2(63.63,53.39) ; v2(61.85,49.96) 57.78,45.9 57.78,4.37 58.42,3.73 59.18,3.73 59.69,3.23 H20.2
HPWR1: length 68
  Top Layer w0.254: H6.2 18.75,29.22 U_HALL_4.1 ; R9.2 v2(35.43,68.89)
  Bottom Layer w0.254: H6.2 18.8,30.91 19.69,31.8 25.27,31.8 26.29,32.82 26.29,39.04 27.05,39.8 32.77,39.8 33.78,40.82 33.78,64.19 35.43,65.84 v2(35.43,68.89)
HPWR2: length 23.2
  Top Layer w0.254: R29.2 77.09,70.79 77.47,71.17 77.47,72.44 77.98,72.95 82.8,72.95 83.19,72.57 H12.2 94.19,70.79 U_HALL_5.1
PWM1: length 119.6
  Top Layer w0.254: U1.19 29.19,50.33 29.84,50.98 31.5,50.98 32,51.49 v2(32,53.14)
  Bottom Layer w0.254: H19.1 3.43,1.57 2.41,2.59 2.41,24.69 3.17,25.45 11.3,25.45 12.32,26.47 12.32,40.31 12.83,40.82 13.72,40.82 14.35,41.45 14.35,51.23 15.37,52.25 20.83,52.25 21.72,53.14 v2(32,53.14)
PWM2: length 73.7
  Top Layer w0.254: v2(80.14,50.33) U3.19
  Bottom Layer w0.254: H20.1 62.23,3.61 61.21,4.62 61.21,29.13 60.96,29.39 59.18,29.39 58.42,30.15 58.42,45.39 60.45,47.42 79.38,47.42 80.14,48.18 v2(80.14,50.33)
RD1: length 71.6
  Top Layer w0.254: v2(4.32,23.67) 4.28,23.64 LED1.1 4.28,18.58 R15.2 ; v2(34.54,53.52) 34.54,50.6 34.43,50.48 R12.1 30.11,50.48 29.3,49.67 U1.18
  Bottom Layer w0.254: v2(4.32,23.67) 22.35,23.67 26.8,28.12 26.8,38.91 27.18,39.29 33.27,39.29 34.54,40.56 v2(34.54,53.52)
RD2: length 49.2
  Top Layer w0.254: v2(82.67,50.1) R32.1 81.11,49.67 U3.18 ; R35.2 95.54,17.88 LED2.1 95.54,23.76 v2(95.5,23.8)
  Bottom Layer w0.254: v2(95.5,23.8) 84.2,23.8 83.57,24.44 83.57,49.2 v2(82.67,50.1)
RETRY1: length 11.1
  Top Layer w0.254: C4.2 35.69,55.8 35.18,55.3 31.5,55.3 30.35,54.15 30.35,52.53 30.1,52.28 U1.22
RETRY2: length 6.2
  Top Layer w0.254: U3.22 78.89,52.28 81.15,54.53 C15.2
U1: length 43.1
  Top Layer w0.508: U1.14 29.05,47.08 29.59,46.53 v1(29.59,35.36)
  Bottom Layer w0.508: v1(29.59,35.36) 29.59,8.43 30.23,7.8 UVW1.1
U2: length 43.4
  Top Layer w0.508: U3.14 79.59,47.08 80.23,46.44 UVW2.1
U_HN1: length 42.4
  Top Layer w0.254: U_HALL_1.1 12.2,65.7 13.33,64.57 13.33,55.3 16.36,52.28 U1.3
  Bottom Layer w0.254: H3.1 18.64,68.85 15.48,65.7 U_HALL_1.1
U_HN2: length 118.8
  Top Layer w0.254: U_HALL_2.1 89.71,34.26 89.26,34.72 89.26,59.25 89.15,59.36 89.15,59.36 88.77,59.74 70.74,59.74 70.23,59.23 70.23,52.88 70.84,52.28 U3.3
  Bottom Layer w0.254: H9.1 75.18,63.42 75.56,63.81 75.56,67.36 76.58,68.38 84.84,68.38 85.6,67.61 85.6,64.82 85.72,64.69 91.57,64.69 97.41,58.85 97.41,35.23 96.44,34.26 U_HALL_2.1
U_HP1: length 31.5
  Top Layer w0.254: U1.2 16.98,52.92 14.1,55.8 14.1,68.89 12.2,70.78 U_HALL_1.2
U_HP2: length 61
  Top Layer w0.254: U_HALL_2.2 89.49,29.18 88.9,29.77 88.9,59.11 88.65,59.36 70.87,59.36 70.61,59.11 70.61,53.18 70.87,52.92 U3.2
V_HN1: length 48.8
  Top Layer w0.254: U1.5 14.48,50.97 11.92,53.54 V_HALL_1.1
  Bottom Layer w0.254: H4.1 24.51,69.58 24.51,59.74 18.31,53.54 V_HALL_1.1
V_HN2: length 91.5
  Top Layer w0.254: U3.5 71,50.97 69.47,52.5 69.47,59.49 70.49,60.5 89.28,60.5 90.04,59.74 90.04,46.66 90.28,46.42 V_HALL_2.1
  Bottom Layer w0.254: V_HALL_2.1 96.14,46.42 96.9,47.19 96.9,58.6 91.31,64.19 85.47,64.19 85.09,64.57 85.09,67.36 84.58,67.87 81.15,67.87 80.52,67.23 80.52,63.81 80.14,63.42 H10.1
V_HP1: length 20.9
  Top Layer w0.254: U1.4 15.36,51.62 12.32,54.66 12.32,57.33 11.03,58.62 V_HALL_1.2
V_HP2: length 52
  Top Layer w0.254: 94.23,41.34 90.53,41.34 89.66,42.22 89.66,59.49 89.03,60.12 70.61,60.12 69.85,59.36 69.85,52.63 70.85,51.62 U3.4
VCP1: length 11.1
  Top Layer w0.254: U1.8 15.32,49.03 14.1,47.8 14.1,45.2
VCP2: length 10.8
  Top Layer w0.254: U3.8 69.26,49.03 67.82,50.47 63.5,50.47 63.12,50.09 C13.2
VM: length 277.8
  Top Layer w0.254: C2.1 v2(14.1,39.04) ; R37.1 45.16,32.88 C17.1 29.78,32.88 26.03,36.63 v1(26.03,43.99) ; C13.1 v2(63.12,46.15) ; F1.1 44.32,85.65 44.83,86.16 65.15,86.16 68.96,89.97 R36.1
  Top Layer w0.508: v3(30.48,47.72) U1.15 26.75,47.72 26.03,47.01 v1(26.03,43.99) ; v3(76.07,43.87) 76.07,47.05 76.75,47.72 U3.15 v1(82.04,47.72)
  Top Layer w1.524: v3(30.48,47.72) 47.8,47.72 55.25,55.17 55.25,77.14 53.85,78.54 44.96,78.54 44.32,79.17 F1.1 55.88,82.35 57.91,80.31 57.91,43.61 60.96,40.56 75.31,40.56 76.07,41.33 v3(76.07,43.87)
  Bottom Layer w0.254: v2(14.1,39.04) 24.38,39.04 25.02,39.67 25.02,43.87 25.15,43.99 v1(26.03,43.99) ; v2(63.12,46.15) 64.13,46.15 64.77,45.52 64.77,41.83 66.04,40.56 74.42,40.56 75.06,41.2 75.06,43.74 75.18,43.87 v3(76.07,43.87)
  Bottom Layer w0.508: v1(26.03,43.99) 29.97,43.99 30.48,44.5 v3(30.48,47.72) ; v3(76.07,43.87) 81.28,43.87 82.04,44.63 v1(82.04,47.72)
W1: length 47.6
  Top Layer w0.508: UVW1.3 20.07,11.1 24.13,15.16 24.13,32.31 23.62,32.82 21.97,32.82 19.94,34.85 19.94,46.41 20.61,47.08 U1.11
W2: length 55.6
  Top Layer w0.508: v1(62.74,44.63) 64.13,46.03 68.71,46.03 69.76,47.08 U3.11
  Bottom Layer w0.508: v1(62.74,44.63) 62.74,7.54 64.64,5.64 UVW2.3
W_HN1: length 70.2
  Top Layer w0.254: U1.7 14.19,49.67 12.32,47.8 12.32,41.96 11.74,41.38 W_HALL_1.1
  Bottom Layer w0.254: H5.1 30.29,64.5 29.84,64.06 28.07,64.06 26.54,62.53 26.54,58.98 20.32,52.76 14.99,52.76 13.72,51.49 13.72,41.96 13.14,41.38 W_HALL_1.1
W_HN2: length 54.4
  Top Layer w0.254: U3.7 71.15,49.67 68.71,52.12 68.71,59.87 70.1,61.27 89.66,61.27 90.81,60.12 90.81,58.98 91.2,58.58 W_HALL_2.1
  Bottom Layer w0.254: W_HALL_2.1 94.23,60.25 91.06,63.42 H11.1
W_HP1: length 18.8
  Top Layer w0.254: W_HALL_1.2 10.98,46.46 11.43,46.91 11.43,48.18 13.57,50.33 U1.6
W_HP2: length 43.4
  Top Layer w0.254: W_HALL_2.2 90.69,53.5 90.42,53.77 90.42,59.87 89.41,60.88 70.36,60.88 69.09,59.61 69.09,52.38 71.14,50.33 U3.6
$1N4320: length 4.3
  Top Layer w0.254: R1.1 44.33,62.53 H16.1
$1N4321: length 3.1
  Top Layer w0.254: R2.1 H16.3
$1N4326: length 4.3
  Top Layer w0.254: R3.1 H15.1
$1N4327: length 3.1
  Top Layer w0.254: H15.3 R4.1
$1N4400: length 20.2
  Top Layer w0.254: R10.1 R9.1 35.43,72.17 H5.2 H4.2 H3.2
$1N4410: length 2.8
  Top Layer w0.254: LED1.2 8.64,21.14 R14.2
$1N4451: length 3.4
  Top Layer w0.254: R21.1 H18.1
$1N4452: length 3.7
  Top Layer w0.254: H18.3 R22.1
$1N4457: length 3.4
  Top Layer w0.254: R23.1 H17.1
$1N4458: length 3.7
  Top Layer w0.254: H17.3 R24.1
$1N4519: length 17.4
  Top Layer w0.254: R30.1 R29.1 73.15,70.78 H9.2 H10.2 H11.2
$1N4529: length 3.8
  Top Layer w0.254: R34.2 93.94,21.13 LED2.2
$1N4533: length 5.3
  Top Layer w0.254: R36.2 70.74,95.8 70.99,95.55 70.99,94.54 71.28,94.25 LED3.2
$1N4569: length 3.2
  Top Layer w0.254: U4.3 46.74,32.94 R37.2
$1N4570: length 2.9
  Top Layer w0.254: R38.2 55.33,27.74 LED4.2

## Copper pours and planes (outline as drawn; the poured copper is in the pictures)
GND on Top Layer: 33.02,76.63 33.91,77.52 41.66,77.52 42.54,76.63 42.54,74.09 42.29,73.84 33.53,73.84 33.02,74.35
GND on Top Layer: 20.32,46.15 20.89,46.73 24.45,46.73 24.64,46.53 24.64,40.06 24.51,39.93 20.95,39.93 20.32,40.56
GND on Top Layer: 68.96,45.77 69.9,46.71 74.11,46.71 74.55,46.28 74.55,42.34 74.29,42.09 69.6,42.09 68.96,42.72
GND on Top Layer: 0,100 100,100 100,0 0,0
GND on Bottom Layer: 0,100 100,100 100,0 0,0
VCC on Top Layer: 40.51,97.33 42,98.83 57.67,98.83 58.97,97.52 58.97,88.36 57.78,87.17 41.66,87.17 40.51,88.32
VM on Top Layer: 40.53,85.92 41.53,86.92 57.4,86.92 58.17,86.16 58.17,77.78 57.66,77.27 48.77,77.27 48.51,77.01 48.51,74.13 48.22,73.84 43.05,73.84 42.8,74.09 42.8,78.16 41.15,78.16 40.53,78.78
$1N4538 on Top Layer: 21.72,96.7 23.62,98.6 39.37,98.6 40.39,97.59 40.39,78.66 39.37,77.65 23.75,77.65 21.72,79.68

## Text on the board
Top Silkscreen Layer: U_HP1 | U_HN1 | V_HP1 | V_HN1 | W_HP1 | W_HN1 | GND | HPWR1 | W1 | V1 | INPUT:5-18V | U1 | DAA1 | CMTMOD1 | DAA2 | W2 | V2 | U2 | W_HN2 | W_HP2 | V_HN2 | V_HP2 | U_HN2 | U_HP2 | HPWR2 | PWM1 | FR1 | FG1 | 3V3 | FG2 | FR2 | PWM2 | CMTMOD2
